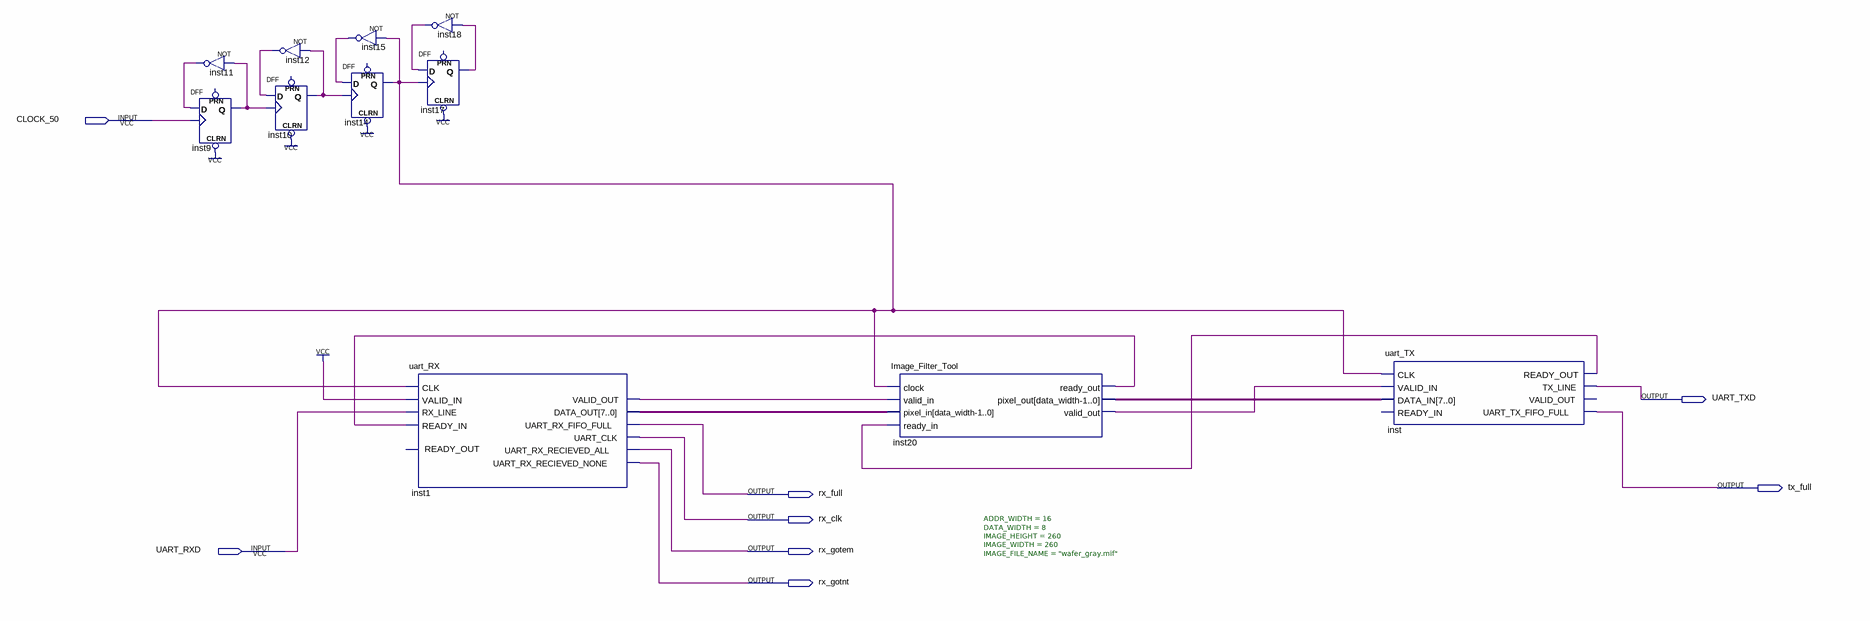
[diagram p0: schematic sheet]
// Quartus schematic top.bdf as structural Verilog: 11 symbols, 8 pins
module top (
  input  CLOCK_50,
  input  UART_RXD,
  output UART_TXD,
  output tx_full,
  output rx_full,
  output rx_clk,
  output rx_gotem,
  output rx_gotnt
);

  wire inst1_valid_out, inst9_q, inst10_q, inst11_out, inst12_out, inst14_q, inst15_out, inst17_q,
       inst18_out, inst20_ready_out, inst20_valid_out, inst_ready_out;
  wire [7:0] inst1_data_out, inst20_pixel_out;

  not inst11 (inst11_out, inst9_q);
  DFF inst9 (.CLRN(1'b1), .CLK(CLOCK_50), .D(inst11_out), .Q(inst9_q));  // open: PRN
  DFF inst10 (.CLRN(1'b1), .CLK(inst9_q), .D(inst12_out), .Q(inst10_q));  // open: PRN
  not inst12 (inst12_out, inst10_q);
  not inst15 (inst15_out, inst14_q);
  DFF inst14 (.CLRN(1'b1), .CLK(inst10_q), .D(inst15_out), .Q(inst14_q));  // open: PRN
  DFF inst17 (.CLRN(1'b1), .CLK(inst14_q), .D(inst18_out), .Q(inst17_q));  // open: PRN
  uart_RX inst1 (
    .CLK(inst14_q), .VALID_IN(1'b1), .RX_LINE(UART_RXD), .READY_IN(inst20_ready_out), .UART_CLK(rx_clk),
    .DATA_OUT(inst1_data_out), .VALID_OUT(inst1_valid_out), .UART_RX_FIFO_FULL(rx_full),
    .UART_RX_RECIEVED_ALL(rx_gotem), .UART_RX_RECIEVED_NONE(rx_gotnt));  // open: READY_OUT
  not inst18 (inst18_out, inst17_q);
  Image_Filter_Tool #(.ADDR_WIDTH(16), .DATA_WIDTH(8), .IMAGE_HEIGHT(260), .IMAGE_WIDTH(260), .IMAGE_FILE_NAME("wafer_gray.mif")) inst20 (
    .clock(inst14_q), .valid_in(inst1_valid_out), .pixel_in(inst1_data_out), .ready_in(inst_ready_out),
    .ready_out(inst20_ready_out), .pixel_out(inst20_pixel_out), .valid_out(inst20_valid_out));
  uart_TX inst (
    .CLK(inst14_q), .VALID_IN(inst20_valid_out), .DATA_IN(inst20_pixel_out), .READY_OUT(inst_ready_out),
    .TX_LINE(UART_TXD), .UART_TX_FIFO_FULL(tx_full));  // open: READY_IN, VALID_OUT
endmodule
